# EAGLE design Stm32-mez (EAGLE 7.2.0)
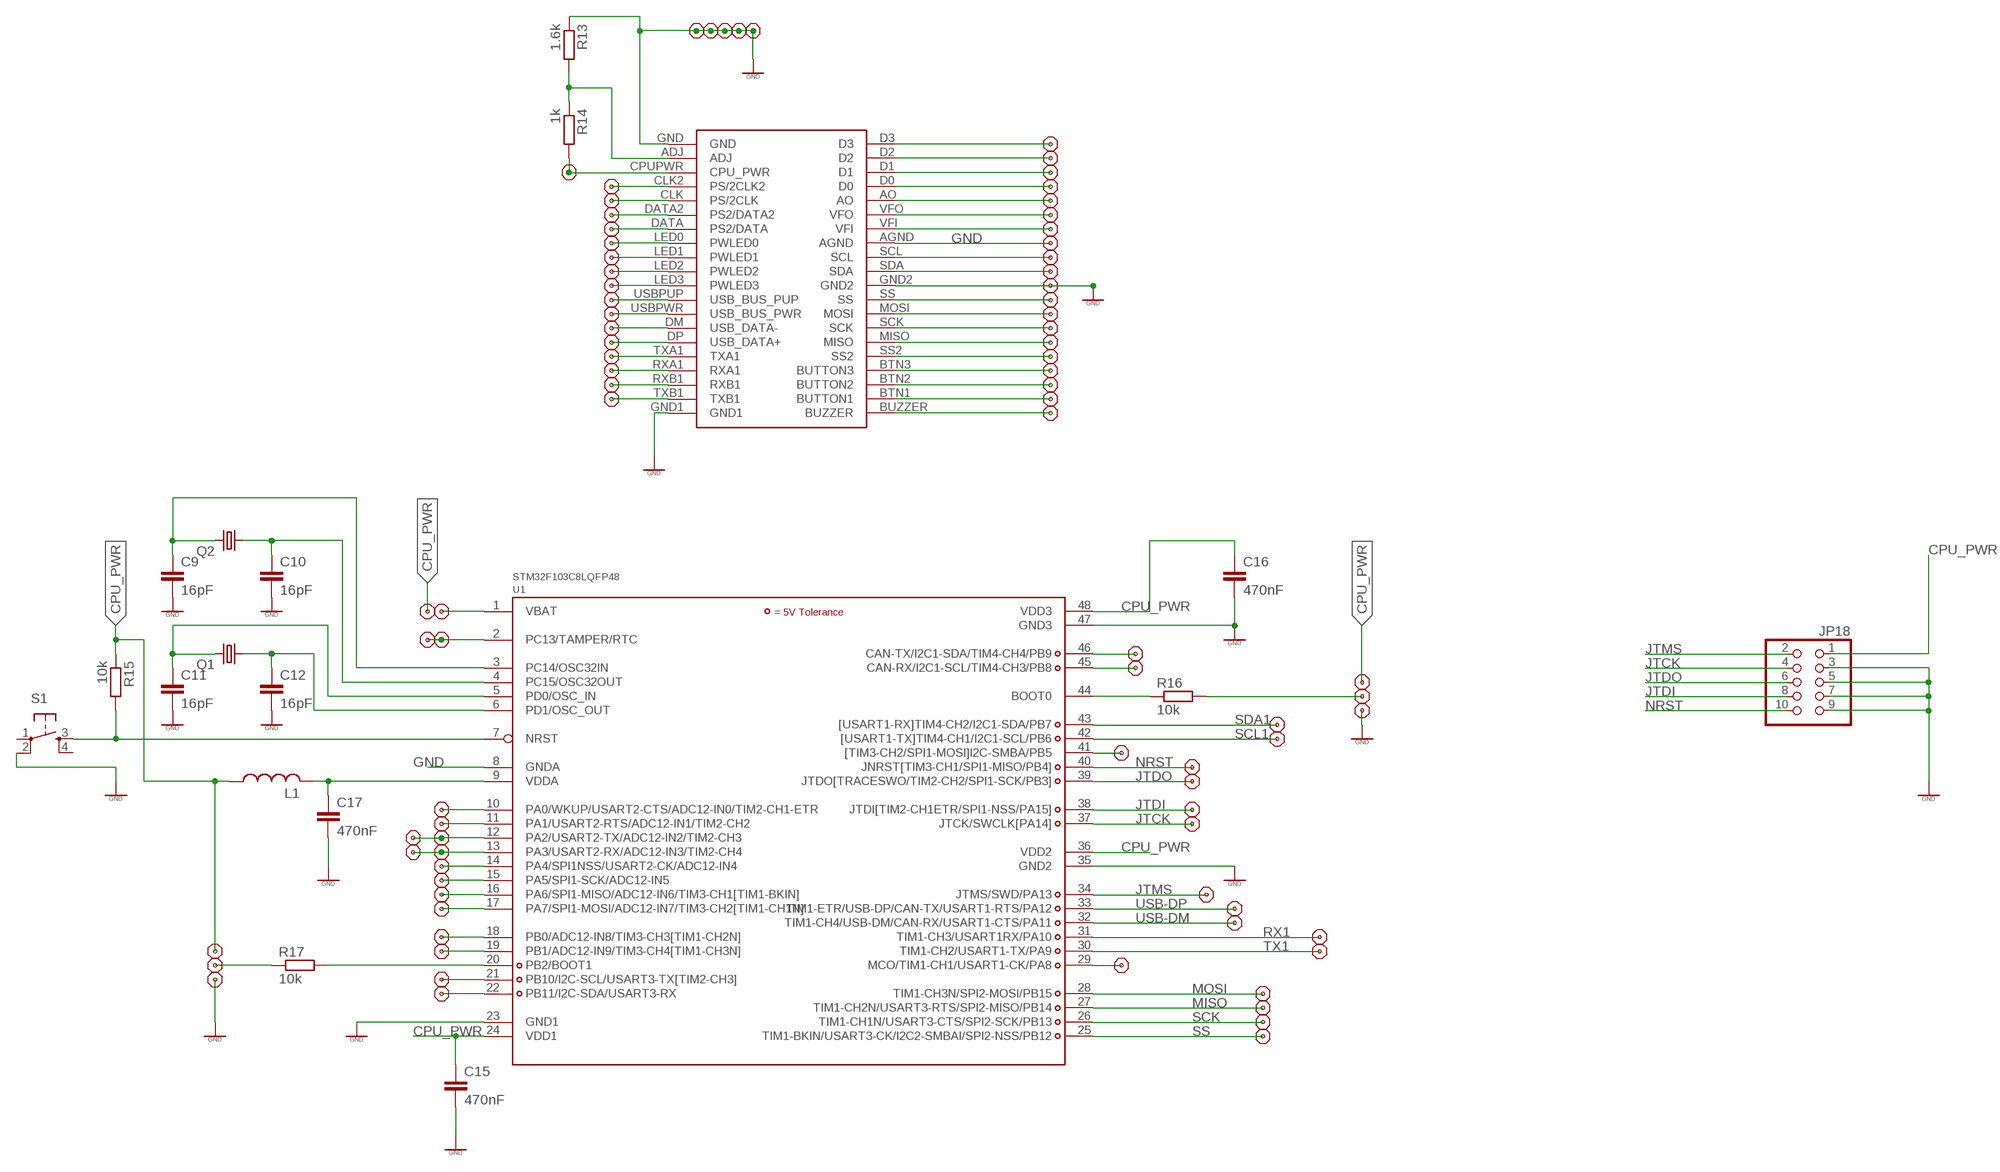
[diagram p0: schematic, sheet 1]

## Parts
C9  16pF  C-EUC1206  [C1206]
C10  16pF  C-EUC1206  [C1206]
C11  16pF  C-EUC1206  [C1206]
C12  16pF  C-EUC1206  [C1206]
C15  470nF  C-EUC1206  [C1206]
C16  470nF  C-EUC1206  [C1206]
C17  470nF  C-EUC1206  [C1206]
JP5  PINHD-1X1PIN  [1X01]
JP6  PINHD-1X1PIN  [1X01]
JP7  PINHD-1X1PIN  [1X01]
JP8  PINHD-1X1PIN  [1X01]
JP10  PINHD-1X1PIN  [1X01]
JP11  PINHD-1X1PIN  [1X01]
JP12  PINHD-1X1PIN  [1X01]
JP13  PINHD-1X1PIN  [1X01]
JP14  PINHD-1X1PIN  [1X01]
JP15  PINHD-1X1PIN  [1X01]
JP16  PINHD-1X1PIN  [1X01]
JP17  PINHD-1X1PIN  [1X01]
JP18  PINHD-2X5  [2X05]
JP19  PINHD-1X1PIN  [1X01]
JP20  PINHD-1X1PIN  [1X01]
JP21  PINHD-1X1PIN  [1X01]
JP22  PINHD-1X1PIN  [1X01]
JP23  PINHD-1X1PIN  [1X01]
JP24  PINHD-1X1PIN  [1X01]
JP25  PINHD-1X1PIN  [1X01]
JP26  PINHD-1X1PIN  [1X01]
JP27  PINHD-1X1PIN  [1X01]
JP28  PINHD-1X1PIN  [1X01]
JP29  PINHD-1X1PIN  [1X01]
JP30  PINHD-1X1PIN  [1X01]
JP31  PINHD-1X1PIN  [1X01]
JP32  PINHD-1X1PIN  [1X01]
JP33  PINHD-1X1PIN  [1X01]
JP34  PINHD-1X1PIN  [1X01]
JP35  PINHD-1X1PIN  [1X01]
JP36  PINHD-1X1PIN  [1X01]
JP37  PINHD-1X1PIN  [1X01]
JP38  PINHD-1X1PIN  [1X01]
JP39  PINHD-1X1PIN  [1X01]
JP40  PINHD-1X1PIN  [1X01]
JP41  PINHD-1X1PIN  [1X01]
JP42  PINHD-1X1PIN  [1X01]
JP43  PINHD-1X1PIN  [1X01]
JP44  PINHD-1X1PIN  [1X01]
JP45  PINHD-1X1PIN  [1X01]
JP46  PINHD-1X1PIN  [1X01]
JP47  PINHD-1X1PIN  [1X01]
JP48  PINHD-1X1PIN  [1X01]
JP49  PINHD-1X1PIN  [1X01]
JP50  PINHD-1X1PIN  [1X01]
JP51  PINHD-1X1PIN  [1X01]
JP52  PINHD-1X1PIN  [1X01]
JP53  PINHD-1X1PIN  [1X01]
JP54  PINHD-1X1PIN  [1X01]
JP55  PINHD-1X1PIN  [1X01]
JP56  PINHD-1X1PIN  [1X01]
JP57  PINHD-1X1PIN  [1X01]
JP58  PINHD-1X1PIN  [1X01]
JP59  PINHD-1X1PIN  [1X01]
JP60  PINHD-1X1PIN  [1X01]
JP61  PINHD-1X1PIN  [1X01]
JP62  PINHD-1X1PIN  [1X01]
JP63  PINHD-1X1PIN  [1X01]
JP64  PINHD-1X1PIN  [1X01]
JP65  PINHD-1X1PIN  [1X01]
JP66  PINHD-1X1PIN  [1X01]
JP67  PINHD-1X1PIN  [1X01]
JP68  PINHD-1X1PIN  [1X01]
JP69  PINHD-1X1PIN  [1X01]
JP70  PINHD-1X1PIN  [1X01]
JP71  PINHD-1X1PIN  [1X01]
JP72  PINHD-1X1PIN  [1X01]
JP73  PINHD-1X1PIN  [1X01]
JP74  PINHD-1X1PIN  [1X01]
JP75  PINHD-1X1PIN  [1X01]
JP76  PINHD-1X1PIN  [1X01]
JP77  PINHD-1X1PIN  [1X01]
JP78  PINHD-1X1PIN  [1X01]
JP79  PINHD-1X1PIN  [1X01]
JP80  PINHD-1X1PIN  [1X01]
JP81  PINHD-1X1PIN  [1X01]
JP82  PINHD-1X1PIN  [1X01]
JP83  PINHD-1X1PIN  [1X01]
JP84  PINHD-1X1PIN  [1X01]
JP85  PINHD-1X1PIN  [1X01]
JP86  PINHD-1X1PIN  [1X01]
JP87  PINHD-1X1PIN  [1X01]
JP88  PINHD-1X1PIN  [1X01]
JP89  PINHD-1X1PIN  [1X01]
JP90  PINHD-1X1PIN  [1X01]
JP91  PINHD-1X1PIN  [1X01]
L1  L-US0207/15  [0207/15]
Q1  CRYSTALHC49U-V  [HC49U-V]
Q2  CRYSTALTC26H  [TC26H]
R13  1.6k  R-EU_R1206  [R1206]
R14  1k  R-EU_R1206  [R1206]
R15  10k  R-EU_R1206  [R1206]
R16  10k  R-EU_R1206  [R1206]
R17  10k  R-EU_R1206  [R1206]
S1  TAC_SWITCHPTH  [TACTILE-PTH]
U1  STM32F103C8LQFP48  [LQFP48]
U$2  CPU_CON  [CPU_SHIELD]

## Nets
CPU_PWR: C15.1 C16.1 JP5.1 JP16.1 JP18.1 JP24.1 JP54.1 L1.1 R14.2 R15.1 U1.24(VDD1) U1.36(VDD2) U1.48(VDD3) U$2.CPUPWR(CPU_PWR)
GND: C9.2 C10.2 C11.2 C12.2 C15.2 C16.2 C17.2 JP10.1 JP11.1 JP12.1 JP13.1 JP14.1 JP18.3 JP18.5 JP18.7 JP18.9 JP25.1 JP55.1 JP90.1 JP91.1 R13.1 S1.2 U1.8(GNDA) U1.23(GND1) U1.35(GND2) U1.47(GND3) U$2.AGND U$2.GND U$2.GND1 U$2.GND2
JTCK: JP18.4 JP22.1 U1.37(JTCK/SWCLK[PA14])
JTDI: JP18.8 JP21.1 U1.38(JTDI[TIM2-CH1ETR/SPI1-NSS/PA15])
JTDO: JP18.6 JP20.1 U1.39(JTDO[TRACESWO/TIM2-CH2/SPI1-SCK/PB3])
JTMS: JP18.2 JP26.1 U1.34(JTMS/SWD/PA13)
MISO: JP32.1 U1.27(TIM1-CH2N/USART3-RTS/SPI2-MISO/PB14)
MOSI: JP31.1 U1.28(TIM1-CH3N/SPI2-MOSI/PB15)
N$1: R15.2 S1.3 U1.7(NRST)
N$3: R13.2 R14.1 U$2.ADJ
N$4: C12.1 Q1.1 U1.6(PD1/OSC_OUT)
N$5: C11.1 Q1.2 U1.5(PD0/OSC_IN)
N$14: C10.1 Q2.1 U1.4(PC15/OSC32OUT)
N$15: C9.1 Q2.2 U1.3(PC14/OSC32IN)
N$17: JP8.1 JP17.1 U1.2(PC13/TAMPER/RTC)
N$19: R16.1 U1.44(BOOT0)
N$20: JP23.1 R16.2
N$21: JP38.1 U1.46(CAN-TX/I2C1-SDA/TIM4-CH4/PB9)
N$22: JP37.1 U1.45(CAN-RX/I2C1-SCL/TIM4-CH3/PB8)
N$23: JP39.1 U1.41([TIM3-CH2/SPI1-MOSI]I2C-SMBA/PB5)
N$24: JP40.1 U1.29(MCO/TIM1-CH1/USART1-CK/PA8)
N$25: JP41.1 U1.10(PA0/WKUP/USART2-CTS/ADC12-IN0/TIM2-CH1-ETR)
N$26: JP43.1 U1.11(PA1/USART2-RTS/ADC12-IN1/TIM2-CH2)
N$27: JP6.1 JP42.1 U1.12(PA2/USART2-TX/ADC12-IN2/TIM2-CH3)
N$28: JP7.1 JP44.1 U1.13(PA3/USART2-RX/ADC12-IN3/TIM2-CH4)
N$29: JP45.1 U1.14(PA4/SPI1NSS/USART2-CK/ADC12-IN4)
N$30: JP46.1 U1.15(PA5/SPI1-SCK/ADC12-IN5)
N$31: JP47.1 U1.16(PA6/SPI1-MISO/ADC12-IN6/TIM3-CH1[TIM1-BKIN])
N$32: JP48.1 U1.17(PA7/SPI1-MOSI/ADC12-IN7/TIM3-CH2[TIM1-CH1N])
N$33: JP49.1 U1.18(PB0/ADC12-IN8/TIM3-CH3[TIM1-CH2N])
N$34: JP50.1 U1.19(PB1/ADC12-IN9/TIM3-CH4[TIM1-CH3N])
N$35: R17.2 U1.20(PB2/BOOT1)
N$36: JP52.1 U1.21(PB10/I2C-SCL/USART3-TX[TIM2-CH3])
N$37: JP53.1 U1.22(PB11/I2C-SDA/USART3-RX)
N$38: JP51.1 R17.1
N$39: JP73.1 U$2.D3
N$40: JP72.1 U$2.D2
N$41: JP71.1 U$2.D1
N$42: JP70.1 U$2.D0
N$43: JP69.1 U$2.AO
N$44: JP68.1 U$2.VFO
N$45: JP67.1 U$2.VFI
N$46: JP66.1 U$2.SCL
N$47: JP65.1 U$2.SDA
N$48: JP64.1 U$2.SS
N$49: JP63.1 U$2.MOSI
N$50: JP62.1 U$2.SCK
N$51: JP61.1 U$2.MISO
N$52: JP60.1 U$2.SS2
N$53: JP59.1 U$2.BTN3(BUTTON3)
N$54: JP58.1 U$2.BTN2(BUTTON2)
N$55: JP57.1 U$2.BTN1(BUTTON1)
N$56: JP56.1 U$2.BUZZER
N$57: JP74.1 U$2.TXB1
N$58: JP75.1 U$2.RXB1
N$59: JP76.1 U$2.RXA1
N$60: JP77.1 U$2.TXA1
N$61: JP78.1 U$2.DP(USB_DATA+)
N$62: JP79.1 U$2.DM(USB_DATA-)
N$63: JP80.1 U$2.USBPWR(USB_BUS_PWR)
N$64: JP81.1 U$2.USBPUP(USB_BUS_PUP)
N$65: JP82.1 U$2.LED3(PWLED3)
N$66: JP83.1 U$2.LED2(PWLED2)
N$67: JP84.1 U$2.LED1(PWLED1)
N$68: JP85.1 U$2.LED0(PWLED0)
N$69: JP86.1 U$2.DATA(PS2/DATA)
N$70: JP87.1 U$2.DATA2(PS2/DATA2)
N$71: JP88.1 U$2.CLK(PS/2CLK)
N$72: JP89.1 U$2.CLK2(PS/2CLK2)
NRST: JP18.10 JP19.1 U1.40(JNRST[TIM3-CH1/SPI1-MISO/PB4])
RX1: JP27.1 U1.31(TIM1-CH3/USART1RX/PA10)
SCK: JP33.1 U1.26(TIM1-CH1N/USART3-CTS/SPI2-SCK/PB13)
SCL1: JP36.1 U1.42([USART1-TX]TIM4-CH1/I2C1-SCL/PB6)
SDA1: JP35.1 U1.43([USART1-RX]TIM4-CH2/I2C1-SDA/PB7)
SS: JP34.1 U1.25(TIM1-BKIN/USART3-CK/I2C2-SMBAI/SPI2-NSS/PB12)
TX1: JP28.1 U1.30(TIM1-CH2/USART1-TX/PA9)
USB-DM: JP29.1 U1.32(TIM1-CH4/USB-DM/CAN-RX/USART1-CTS/PA11)
USB-DP: JP30.1 U1.33(TIM1-ETR/USB-DP/CAN-TX/USART1-RTS/PA12)
VBAT: JP15.1 U1.1(VBAT)
VDDA: C17.1 L1.2 U1.9(VDDA)
Unconnected: S1.1 S1.4

## Library data of the parts
C9-C12 C15-C17 = rcl:C-EU: CAPACITOR, European symbol
JP5-JP8 JP10-JP17 JP19-JP91 = _pinhead:PINHD-1X1: PIN HEADER
JP18 = _pinhead:PINHD-2X5: PIN HEADER
L1 = rcl:L-US: INDUCTOR, American symbol
Q1 Q2 = crystal:CRYSTAL: CRYSTAL
R13-R17 = rcl:R-EU_: RESISTOR, European symbol
S1 = SparkFun:TAC_SWITCH: Momentary Switch Button commonly used for reset or general input. Spark Fun Electronics SKU : COM-00097
U1 = STM32:STM32F103C8
U$2 = _block:CPU_CON

## Board
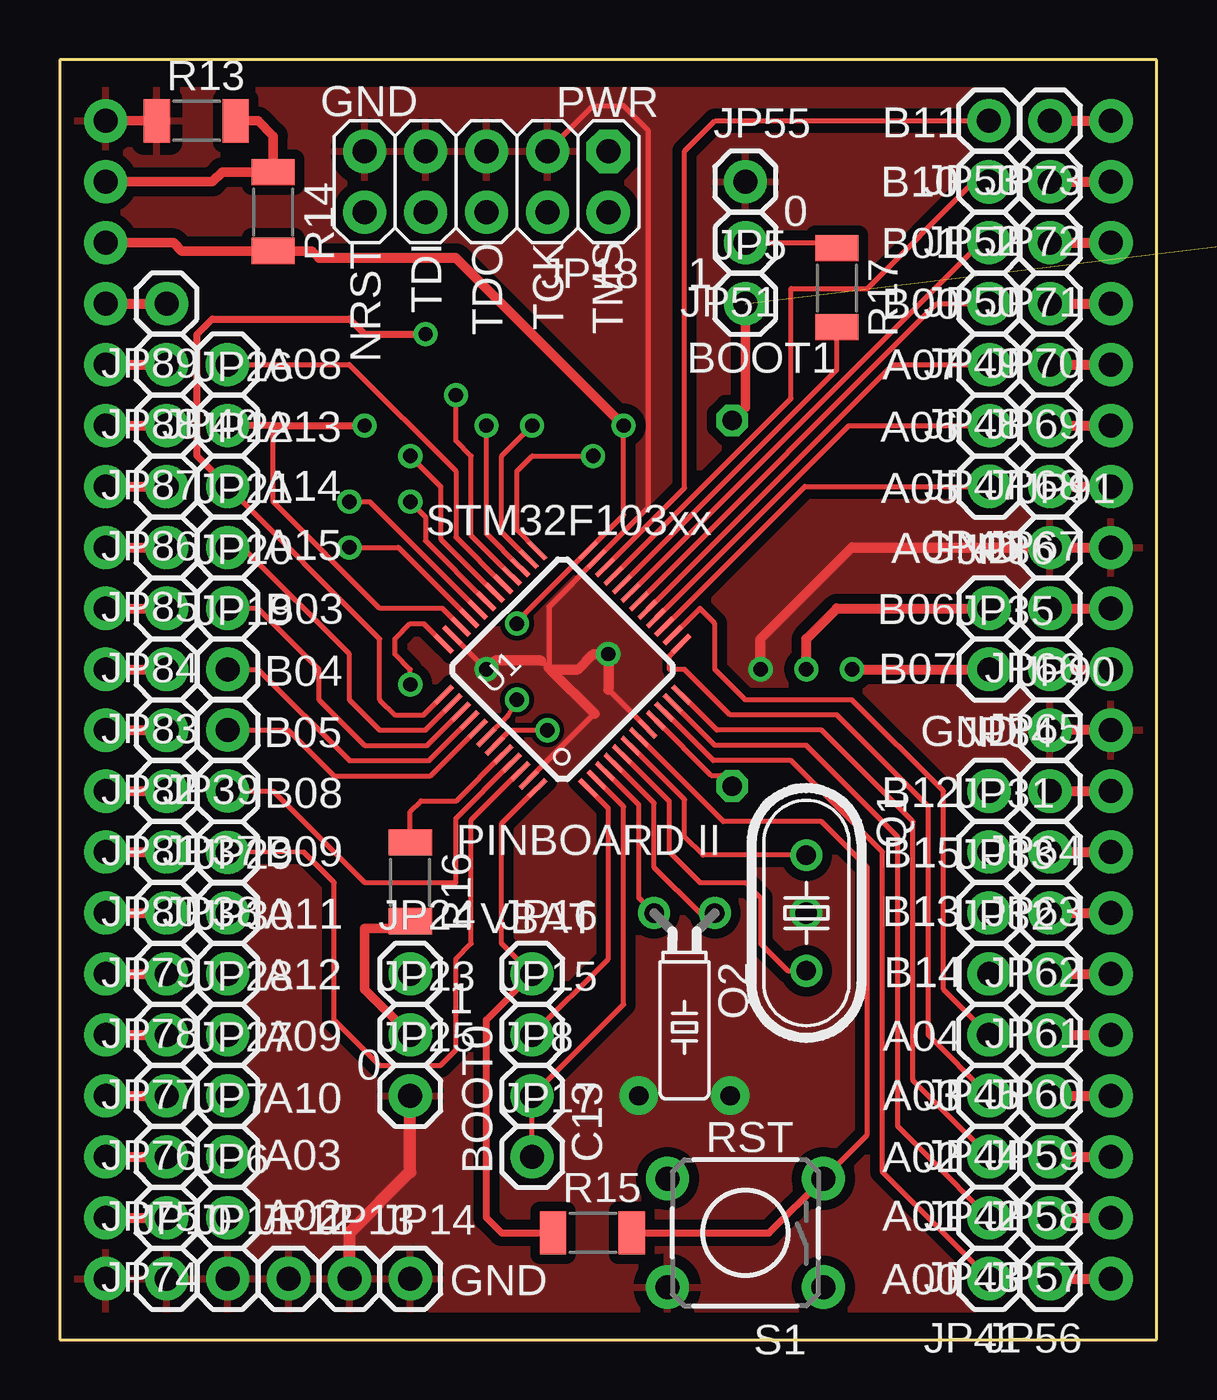
[diagram p1: board, top side]
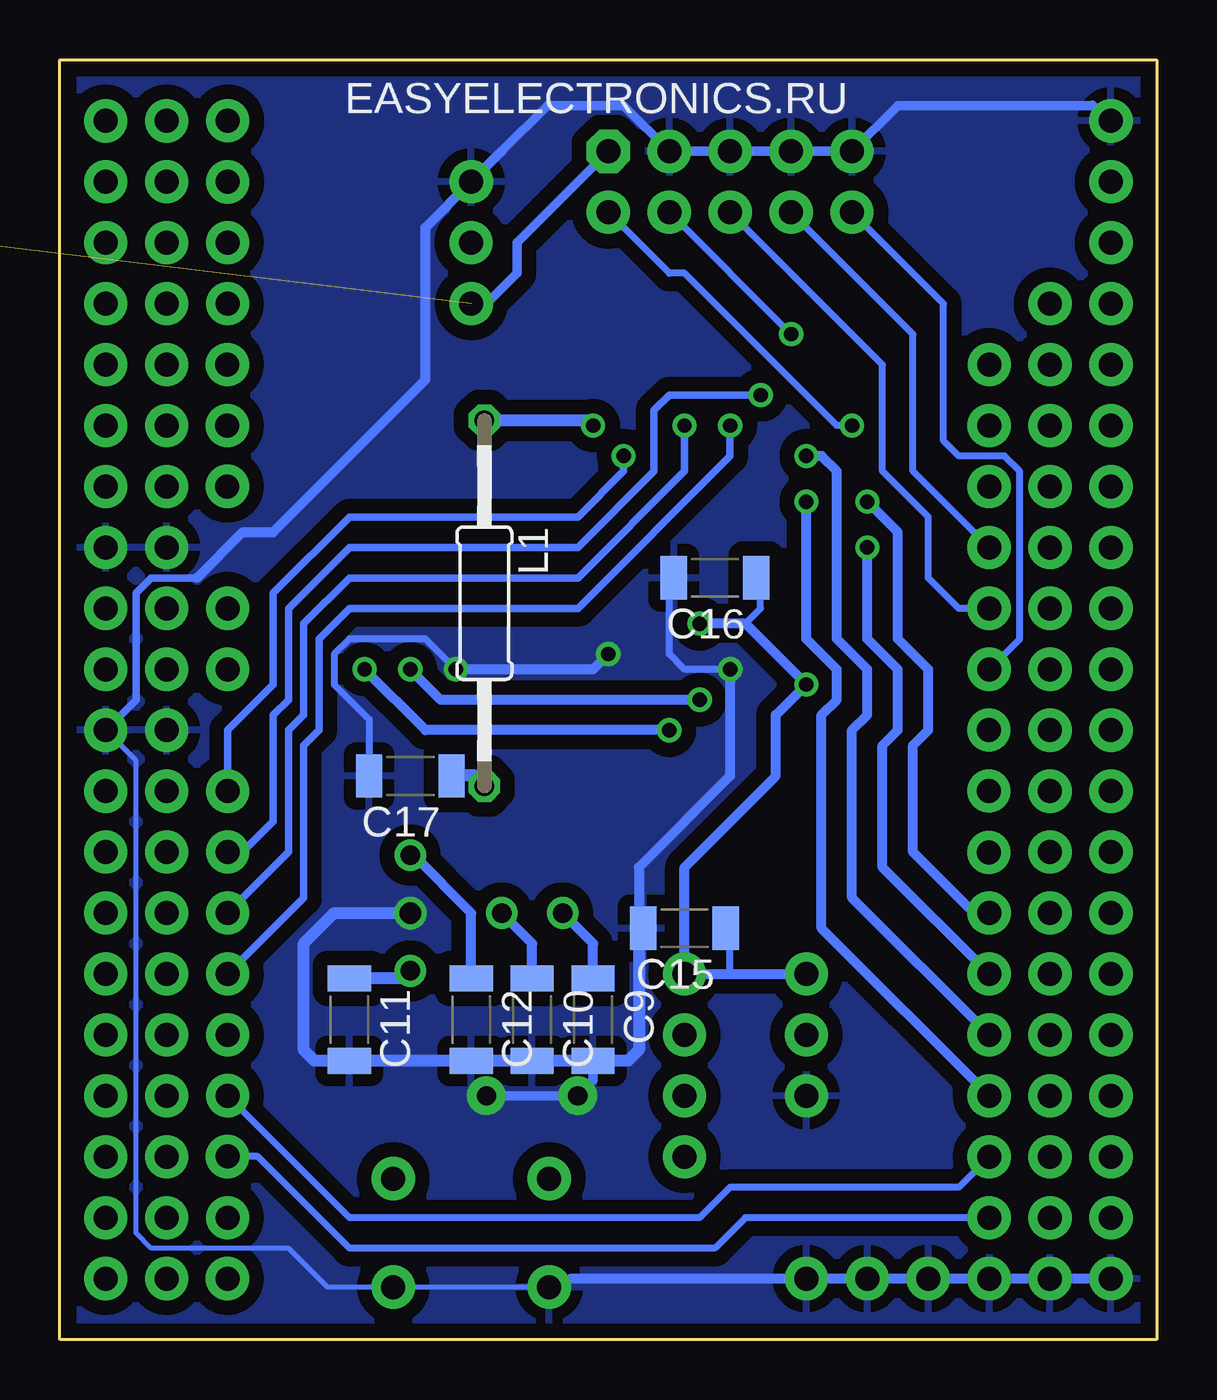
[diagram p2: board, bottom side, seen from below]

Size 45.72 x 53.34 mm. Coordinates in mm from the lower left corner, seen from the top.
Copper layers (1*16): Top 0.035mm / dielectric 1.5mm / Bottom 0.035mm
Design rules "default *": minimum track width 0.15mm, minimum drill 0.6mm, track to track 0.2mm, track to pad 0.2mm, pad to pad 0.2mm, via to via 0.2mm, smd to smd 8mil, copper to edge 0.5mm, drill to drill 8mil, minimum pad ring 10mil, minimum via ring 8mil, stop-mask expansion 4mil, vias tented up to drill 0mil, thermal gap 20mil

### Footprints (pad centres in the part's own frame; a part is rotated, then mirrored left to right if it is on the bottom)
C1206 = smd 1.092 x 1.8: 1 -1.718,0; 2 1.718,0
1X01 = drill 1 pad 1.8: 1 0,0
2X05 = drill 1 pad 1.8 octagon: 1 -5.08,-1.27 | drill 1 pad 1.8: 2 -5.08,1.27; 3 -2.54,-1.27; 4 -2.54,1.27; 5 0,-1.27; 6 0,1.27; 7 2.54,-1.27; 8 2.54,1.27; 9 5.08,-1.27; 10 5.08,1.27
0207/15 = drill 0.813 octagon: 1 -7.62,0; 2 7.62,0
HC49U-V = drill 0.813: 1 -2.413,0; 2 2.413,0
TC26H = drill 0.813: 1 -1.27,0; 2 1.27,0
R1206 = smd 1.092 x 1.803: 1 -1.676,0; 2 1.613,0
TACTILE-PTH = drill 1 pad 1.8: 1 -3.251,2.261; 2 3.251,2.261; 3 -3.251,-2.261; 4 3.251,-2.261
LQFP48 = smd 0.2 x 1: 1 -2.75,-4.25; 2 -2.25,-4.25; 3 -1.75,-4.25; 4 -1.25,-4.25; 5 -0.75,-4.25; 6 -0.25,-4.25; 7 0.25,-4.25; 8 0.75,-4.25; 9 1.25,-4.25; 10 1.75,-4.25; 11 2.25,-4.25; 12 2.75,-4.25; 25 2.75,4.25; 26 2.25,4.25; 27 1.75,4.25; 28 1.25,4.25; 29 0.75,4.25; 30 0.25,4.25; 31 -0.25,4.25; 32 -0.75,4.25; 33 -1.25,4.25; 34 -1.75,4.25; 35 -2.25,4.25; 36 -2.75,4.25 | smd 1 x 0.2: 13 4.25,-2.75; 14 4.25,-2.25; 15 4.25,-1.75; 16 4.25,-1.25; 17 4.25,-0.75; 18 4.25,-0.25; 19 4.25,0.25; 20 4.25,0.75; 21 4.25,1.25; 22 4.25,1.75; 23 4.25,2.25; 24 4.25,2.75; 37 -4.25,2.75; 38 -4.25,2.25; 39 -4.25,1.75; 40 -4.25,1.25; 41 -4.25,0.75; 42 -4.25,0.25; 43 -4.25,-0.25; 44 -4.25,-0.75; 45 -4.25,-1.25; 46 -4.25,-1.75; 47 -4.25,-2.25; 48 -4.25,-2.75
CPU_SHIELD = drill 1 pad 1.8: ADJ 0,-2.54; AGND 41.91,-17.78; AO 41.91,-10.16; BTN1 41.91,-45.72; BTN2 41.91,-43.18; BTN3 41.91,-40.64; BUZZER 41.91,-48.26; CLK 0,-10.16; CLK2 0,-7.62; CPUPWR 0,-5.08; D0 41.91,-7.62; D1 41.91,-5.08; D2 41.91,-2.54; D3 41.91,0; DATA 0,-15.24; DATA2 0,-12.7; DM 0,-33.02; DP 0,-35.56; GND 0,0; GND1 0,-48.26; GND2 41.91,-25.4; LED0 0,-17.78; LED1 0,-20.32; LED2 0,-22.86; LED3 0,-25.4; MISO 41.91,-35.56; MOSI 41.91,-30.48; RXA1 0,-40.64; RXB1 0,-43.18; SCK 41.91,-33.02; SCL 41.91,-20.32; SDA 41.91,-22.86; SS 41.91,-27.94; SS2 41.91,-38.1; TXA1 0,-38.1; TXB1 0,-45.72; USBPUP 0,-27.94; USBPWR 0,-30.48; VFI 41.91,-15.24; VFO 41.91,-12.7

### Placement (x,y rotation side)
C9  23.5,13.33 270 bottom
C10  26.03,13.33 270 bottom
C11  33.66,13.33 270 bottom
C12  28.58,13.33 270 bottom
C15  19.69,17.14 180 bottom
C16  18.41,31.75 180 bottom
C17  31.12,23.49 180 bottom
JP5  28.58,43.18 0 top
JP6  6.98,5.08 0 top
JP7  6.98,7.62 0 top
JP8  19.69,10.16 0 top
JP10  4.45,2.54 0 top
JP11  6.98,2.54 0 top
JP12  9.53,2.54 0 top
JP13  12.07,2.54 0 top
JP14  14.61,2.54 0 top
JP15  19.69,12.7 0 top
JP16  19.69,15.24 0 top
JP17  19.69,7.62 0 top
JP18  17.78,48.26 180 top
JP19  6.98,27.94 0 top
JP20  6.98,30.48 0 top
JP21  6.98,33.02 0 top
JP22  6.98,35.56 0 top
JP23  14.61,12.7 0 top
JP24  14.61,15.24 0 top
JP25  14.61,10.16 0 top
JP26  6.98,38.1 0 top
JP27  6.98,10.16 0 top
JP28  6.98,12.7 0 top
JP29  6.98,17.78 0 top
JP30  6.98,15.24 0 top
JP31  38.73,20.32 0 top
JP32  38.73,15.24 0 top
JP33  38.73,17.78 0 top
JP34  38.73,22.86 0 top
JP35  38.73,27.94 0 top
JP36  38.73,30.48 0 top
JP37  6.99,22.86 180 top
JP38  6.99,20.31 180 top
JP39  6.99,25.41 180 top
JP40  6.98,40.65 180 top
JP41  38.74,2.54 180 top
JP42  38.74,7.63 180 top
JP43  38.73,5.08 180 top
JP44  38.73,10.17 180 top
JP45  38.73,12.7 180 top
JP46  38.74,35.57 180 top
JP47  38.74,38.1 180 top
JP48  38.74,40.64 180 top
JP49  38.73,43.18 180 top
JP50  38.73,45.72 180 top
JP51  28.58,45.73 180 top
JP52  38.73,48.26 180 top
JP53  38.73,50.81 180 top
JP54  68.58,38.73 0 top  (outside the outline)
JP55  28.58,48.26 0 top
JP56  41.28,2.54 180 top
JP57  41.28,5.08 180 top
JP58  41.28,7.62 180 top
JP59  41.28,10.16 180 top
JP60  41.28,12.7 180 top
JP61  41.28,15.24 180 top
JP62  41.28,17.78 180 top
JP63  41.28,20.32 180 top
JP64  41.28,22.86 180 top
JP65  41.28,27.94 180 top
JP66  41.28,30.48 180 top
JP67  41.28,35.56 180 top
JP68  41.28,38.1 180 top
JP69  41.28,40.64 180 top
JP70  41.28,43.18 180 top
JP71  41.28,45.72 180 top
JP72  41.28,48.26 180 top
JP73  41.28,50.8 180 top
JP74  4.45,5.08 180 top
JP75  4.45,7.62 180 top
JP76  4.45,10.16 180 top
JP77  4.45,12.7 180 top
JP78  4.45,15.24 180 top
JP79  4.45,17.78 180 top
JP80  4.45,20.32 180 top
JP81  4.45,22.86 180 top
JP82  4.45,25.4 180 top
JP83  4.45,27.94 180 top
JP84  4.45,30.48 180 top
JP85  4.45,33.02 180 top
JP86  4.45,35.56 180 top
JP87  4.45,38.1 180 top
JP88  4.45,40.64 180 top
JP89  4.45,43.18 180 top
JP90  41.28,25.4 0 top
JP91  41.28,33.02 0 top
L1  28.03,30.7 270 bottom
Q1  31.12,17.78 270 top
Q2  26.03,17.78 180 top
R13  5.72,50.8 0 top
R14  8.89,46.99 270 top
R15  22.23,4.44 0 top
R16  14.61,19.05 270 top
R17  32.39,43.81 270 top
S1  28.58,4.44 180 top
U1  20.95,27.94 45 top
U$2  1.91,50.8 0 top

### Tracks (layer width: path | path; a pad name or v marks a point on that pad's centre or on a via)
CPU_PWR  (via drill 0.6)  (11 unrouted)
  Top 0.2: U1.48 18.41,21.51 18.41,16.51 JP16.1 | U1.36 15.16,29.84 14.61,29.84 13.97,29.21 13.97,28.57 14.61,27.94 v14.61,27.3 | v19.05,29.84 19.05,29.92 U1.24 23.5,34.37 v23.5,38.1
  Top 0.3: JP16.1 17.78,13.33 17.78,5.08 18.41,4.44 R15.1
  Top 0.4: JP5.1 28.58,38.85 28.56,38.85 L1.1 | U$2.CPUPWR 4.74,45.72 5.08,45.38 R14.2 10.5,45.38 10.8,45.08
  Top 0.406: v23.5,38.1 16.51,45.08 10.8,45.08
  Bottom 0.3: C15.1 17.78,16.32 17.78,15.24 | C16.1 16.51,32.2 16.51,30.48 17.15,29.84
  Bottom 0.4: JP18.1 26.67,45.72 26.67,44.45 27.94,43.18 JP5.1
  Bottom 0.406: JP24.1 17.78,15.24 JP16.1 19.69,19.68 15.88,23.49 15.88,26.03 v14.61,27.3 17.15,29.84 v19.05,29.84
  Bottom 0.5: L1.1 23.71,38.31 v23.5,38.1
GND  (via drill 0.6, 0.8 pad 1.6, 0.9)
  Top 0.2: 22.29,26.09 U1.47 | 16.37,29.35 U1.35 v17.77,27.94 v17.78,27.94 | 20.08,28.3 20.38,28 20.38,30.54 U1.23 24.51,34.68 24.51,50.42 23.5,51.43 22.23,51.43 JP18.3 | 22.86,27.1 U1.8
  Top 0.4: U$2.GND R13.1
  Top 0.406: 20.44,27.94 22.29,26.09 | 20.08,28.3 18.14,28.3 v17.78,27.94 | v29.21,27.94 29.21,29.21 33.02,33.02 JP91.1 U$2.AGND | 22.86,27.1 v22.86,28.57 22.23,28.57 21.59,27.94 20.44,27.94 | 20.38,28 20.44,27.94 | U$2.GND2 JP90.1
  Top 0.5: JP25.1 14.61,6.98 12.07,4.44 JP13.1
  Bottom 0.2: 1.97,50.74 U$2.GND | C9.2 23.31,11.43 | U$2.GND2 42.55,24.13 42.55,4.44 41.91,3.81 36.2,3.81 34.57,2.18 S1.2
  Bottom 0.3: 21.59,17.14 C15.2 | C16.2 20.32,32.2 20.32,28.57 19.69,27.94 v17.78,27.94 | C17.2 32.83,25.85 34.29,27.3 34.29,28.57 33.66,29.21 30.48,29.21 v29.21,27.94
  Bottom 0.305: U$2.GND2 42.55,26.67 42.55,31.11 41.91,31.75 40,31.75
  Bottom 0.4: C12.2 28.76,11.43 | 23.5,11.43 C9.2 23.5,10.79 v24.13,10.16 v27.94,10.16 | 27.31,49.53 25.4,51.43 22.23,51.43 JP18.3 JP18.5 JP18.7 JP18.9 10.8,51.43 2.66,51.43
  Bottom 0.406: 2.66,51.43 1.97,50.74 | 27.31,49.53 JP55.1 30.48,46.35 30.48,40 36.83,33.65 38.1,33.65 40,31.75 | 21.59,17.14 21.59,19.68 17.78,23.49 v17.78,27.94 | v29.21,27.94 23.5,27.94 v22.86,28.57 | U$2.GND1 JP10.1 JP11.1 JP12.1 JP13.1 JP14.1 24.41,2.54 S1.2
  Bottom 0.5: C9.2 22.04,11.62 21.59,12.06 21.59,17.14 | 23.5,11.43 23.68,11.62 C10.2 C12.2 C11.2 35.11,11.62 35.56,12.06 35.56,16.51 34.29,17.78 v31.12,17.78
  pour Top: 16.51,27.94 20.95,32.38 25.4,27.94 20.95,23.49
  pour Top (isolate 0.406): 45.09,1.27 0.64,1.27 0.64,52.07 45.09,52.07
  pour Bottom (isolate 0.61): 0.64,0.63 0.64,52.7 45.09,52.7 45.09,0.63
JTCK  (via drill 0.6)
  Top 0.2: U1.37 15.16,26.03 13.97,26.03 13.34,26.67 13.34,29.21 JP22.1
  Top 0.3: JP22.1 5.72,36.83 5.72,41.91 6.35,42.54 12.07,42.54 12.7,41.91 v15.24,41.91
  Bottom 0.3: v15.24,41.91 JP18.4
JTDI
  Top 0.2: U1.38 15.23,25.4 13.34,25.4 12.07,26.67 12.07,28.57 7.62,33.02 JP21.1
  Bottom 0.3: JP18.8 10.16,41.91 10.16,36.19 JP21.1
JTDO
  Top 0.2: U1.39 15.3,24.76 12.7,24.76 10.8,26.67 10.8,27.94 8.26,30.48 JP20.1
  Bottom 0.3: JP18.6 11.43,40.64 11.43,36.19 9.53,34.29 9.53,31.75 8.26,30.48 JP20.1
JTMS  (via drill 0.6)
  Top 0.2: U1.34 15.94,30.48 13.34,30.48 8.89,34.92 8.89,38.1
  Top 0.3: JP26.1 8.89,38.1 v12.7,38.1
  Bottom 0.3: JP18.2 20.32,44.45 19.69,44.45 13.34,38.1 v12.7,38.1
MISO  (via drill 0.6)
  Top 0.2: U1.27 17.78,33.59 v17.78,38.1
  Bottom 0.305: JP32.1 35.56,18.41 35.56,24.76 34.92,25.4 34.92,29.21 33.66,30.48 24.13,30.48 17.78,36.83 v17.78,38.1
MOSI  (via drill 0.6)
  Top 0.2: U1.28 17.15,33.52 17.15,36.83 16.51,37.46 v16.51,39.37
  Bottom 0.305: JP31.1 38.1,20.32 36.83,21.59 36.83,26.03 36.2,26.67 36.2,30.48 33.66,33.02 24.13,33.02 20.95,36.19 20.95,38.73 20.32,39.37 v16.51,39.37
N$1
  Top 0.2: U1.7 27.66,21.59 31.75,21.59 33.66,19.68 33.66,8.53 S1.3
  Top 0.3: S1.3 29.57,4.44 R15.2
N$3
  Top 0.4: R13.2 8.26,50.8 8.89,50.16 R14.1 6.76,48.67 6.35,48.26 U$2.ADJ
N$4
  Top 0.2: U1.6 26.03,22.51 26.03,20.95 26.8,20.19 Q1.1
  Bottom 0.2: 30.99,20.19 Q1.1
  Bottom 0.406: C12.1 28.58,17.78 30.99,20.19
N$5
  Top 0.2: U1.5 25.4,22.43 25.4,20.32 26.67,19.05 28.58,19.05 29.21,18.41 29.21,16.51 30.35,15.37 Q1.2
  Bottom 0.5: C11.1 31.43,15.05 Q1.2
N$14
  Top 0.2: U1.4 24.77,22.36 24.77,19.68 26.67,17.78 Q2.1
  Bottom 0.406: C10.1 26.03,16.51 Q2.1
N$15
  Top 0.2: U1.3 24.13,22.29 24.13,18.41 Q2.2
  Bottom 0.406: C9.1 23.5,16.51 Q2.2
N$17
  Top 0.2: U1.2 23.5,22.22 23.5,13.97 JP8.1 JP17.1
N$19
  Top 0.2: U1.44 16.53,22.45 15.05,22.45 14.61,22.01 R16.1
N$20
  Top 0.2: 14.64,17.4 R16.2 13.97,17.14 | JP23.1
  Top 0.4: JP23.1 12.7,14.6 12.7,17.14 13.97,17.14
N$21
  Top 0.2: U1.46 17.15,21.65 17.15,16.51 16.51,15.87 16.51,12.06 15.88,11.43 13.34,11.43 11.43,13.33 11.43,19.05 10.16,20.32 JP38.1
N$22
  Top 0.2: U1.45 16.51,21.73 16.51,19.05 12.7,19.05 8.89,22.86 JP37.1
N$23
  Top 0.2: U1.41 15.45,23.49 11.43,23.49 9.52,25.41 JP39.1
N$24
  Top 0.2: U1.29 16.51,33.45 16.51,36.19 12.06,40.65 JP40.1
N$25
  Top 0.2: 36.83,4.44 34.29,6.98 34.29,20.32 30.48,24.13 27.24,24.13 U1.10 | 36.83,4.44 | JP41.1 36.83,4.44
N$26
  Top 0.2: U1.11 27.31,24.76 31.12,24.76 34.92,20.95 34.92,8.89 36.2,7.62 36.2,7.61 JP43.1
N$27
  Top 0.2: JP42.1 36.83,9.53 36.83,9.52 35.56,10.79 35.56,21.59 31.75,25.4 27.38,25.4 U1.12
  Bottom 0.3: JP6.1 17.15,5.08 18.41,3.81 33.66,3.81 37.47,7.63 JP42.1
N$28
  Top 0.2: JP44.1 36.2,12.7 36.2,22.22 32.39,26.03 27.94,26.03 26.03,27.94 25.4,27.94 25.4,28.5 U1.13
  Bottom 0.3: JP7.1 8.26,6.35 17.78,6.35 19.05,5.08 33.66,5.08 JP44.1
N$29
  Top 0.2: JP45.1 36.83,14.6 36.83,22.86 33.02,26.67 28.58,26.67 27.31,27.94 27.31,29.84 26.67,30.47 U1.14
N$30
  Top 0.2: U1.15 31.06,35.56 JP46.1
N$31
  Top 0.2: U1.16 32.88,38.1 JP47.1
N$32
  Top 0.2: U1.17 34.72,40.64 JP48.1
N$33
  Top 0.2: U1.18 36.55,43.18 JP49.1
N$34
  Top 0.2: U1.19 38.39,45.72 JP50.1
N$35
  Top 0.2: U1.20 32.39,40.43 R17.2
N$36
  Top 0.2: U1.21 30.48,39.23 30.48,43.81 33.66,43.81 38.1,48.26 JP52.1
N$37
  Top 0.2: U1.22 26.03,35.49 26.03,49.53 27.31,50.8 JP53.1
N$38
  Top 0.2: R17.1 31.52,45.73 JP51.1
N$39
  Top 0.406: JP73.1 U$2.D3
N$40
  Top 0.406: JP72.1 U$2.D2
N$41
  Top 0.406: JP71.1 U$2.D1
N$42
  Top 0.406: JP70.1 U$2.D0
N$43
  Top 0.406: JP69.1 U$2.AO
N$44
  Top 0.406: JP68.1 U$2.VFO
N$45
  Top 0.406: JP67.1 U$2.VFI
N$46
  Top 0.406: JP66.1 U$2.SCL
N$47
  Top 0.406: JP65.1 U$2.SDA
N$48
  Top 0.406: JP64.1 U$2.SS
N$49
  Top 0.406: JP63.1 U$2.MOSI
N$50
  Top 0.406: JP62.1 U$2.SCK
N$51
  Top 0.406: JP61.1 U$2.MISO
N$52
  Top 0.406: JP60.1 U$2.SS2
N$53
  Top 0.406: JP59.1 U$2.BTN3
N$54
  Top 0.406: JP58.1 U$2.BTN2
N$55
  Top 0.406: JP57.1 U$2.BTN1
N$56
  Top 0.406: JP56.1 U$2.BUZZER
N$57
  Top 0.406: U$2.TXB1 JP74.1
N$58
  Top 0.406: U$2.RXB1 JP75.1
N$59
  Top 0.406: U$2.RXA1 JP76.1
N$60
  Top 0.406: U$2.TXA1 JP77.1
N$61
  Top 0.406: U$2.DP JP78.1
N$62
  Top 0.406: U$2.DM JP79.1
N$63
  Top 0.406: U$2.USBPWR JP80.1
N$64
  Top 0.406: U$2.USBPUP JP81.1
N$65
  Top 0.406: U$2.LED3 JP82.1
N$66
  Top 0.406: U$2.LED2 JP83.1
N$67
  Top 0.406: U$2.LED1 JP84.1
N$68
  Top 0.406: U$2.LED0 JP85.1
N$69
  Top 0.406: U$2.DATA JP86.1
N$70
  Top 0.406: U$2.DATA2 JP87.1
N$71
  Top 0.406: U$2.CLK JP88.1
N$72
  Top 0.406: U$2.CLK2 JP89.1
NRST
  Top 0.2: U1.40 15.38,24.13 12.07,24.13 8.26,27.94 JP19.1
  Bottom 0.3: JP18.10 8.89,43.18 8.89,37.46 8.26,36.83 6.35,36.83 5.72,36.19 5.72,29.21 JP19.1
RX1  (via drill 0.6)
  Top 0.2: U1.31 15.24,33.3 15.24,34.29 v14.61,34.92
  Bottom 0.406: JP27.1 13.97,17.14 13.97,26.03 13.34,26.67 13.34,27.94 14.61,29.21 v14.61,34.92
SCK  (via drill 0.6)
  Top 0.2: U1.26 18.41,33.66 18.41,36.83 v19.69,38.1
  Bottom 0.305: JP33.1 36.2,20.32 36.2,25.4 35.56,26.03 35.56,29.84 33.66,31.75 24.13,31.75 19.69,36.19 v19.69,38.1
SCL1  (via drill 0.6)
  Top 0.2: v19.05,26.67 18.7,26.03 U1.42
  Top 0.406: JP36.1 32.39,30.48 31.12,29.21 v31.12,27.94
  Bottom 0.406: v31.12,27.94 29.84,26.67 v19.05,26.67
SDA1  (via drill 0.6)
  Top 0.2: v20.32,25.4 18.77,25.4 U1.43
  Top 0.406: v33.02,27.94 JP35.1
  Bottom 0.406: v33.02,27.94 30.48,25.4 v20.32,25.4
SS  (via drill 0.6)
  Top 0.2: U1.25 19.05,33.73 19.05,36.19 19.69,36.83 v22.23,36.83
  Bottom 0.305: JP34.1 38.73,25.4 36.83,27.3 36.83,31.11 33.66,34.29 24.13,34.29 22.23,36.19 v22.23,36.83
TX1  (via drill 0.6)
  Top 0.2: U1.30 15.88,33.37 15.88,35.56 v14.61,36.83
  Bottom 0.406: JP28.1 12.7,18.41 12.7,25.4 12.07,26.03 12.07,27.94 13.34,29.21 13.34,36.19 13.97,36.83 v14.61,36.83
USB-DM  (via drill 0.6)
  Top 0.2: U1.32 12.91,34.92 v12.07,34.92
  Bottom 0.406: JP29.1 7.62,17.78 10.16,20.32 10.16,24.76 9.53,25.4 9.53,27.94 10.8,29.21 10.8,33.65 v12.07,34.92
USB-DP  (via drill 0.6)
  Top 0.2: U1.33 14.11,33.02 v12.07,33.02
  Bottom 0.406: JP30.1 11.43,19.68 11.43,24.76 10.8,25.4 10.8,27.94 12.07,29.21 v12.07,33.02
VBAT
  Top 0.2: U1.1 22.86,22.15 22.86,15.87 JP15.1
VDDA
  Top 0.2: U1.9 27.14,23.52 27.58,23.52 L1.2
  Bottom 0.4: 29.37,23.52 C17.1
  Bottom 0.5: 29.37,23.52 28.47,23.52 L1.2

### Text on the board
tPlace: PWR | GND | B11 | B10 | 0 | B01 | NRST | TDI | TDO | TCK | TMS | 1 | B00 | A07 | A08 | BOOT1 | A06 | A13 | A05 | A14 | STM32F103xx | AGND | A15 | B06 | B03 | B07 | B04 | GND | B05 | B12 | B08 | B15 | PINBOARD II | B09 | B13 | A11 | VBAT | B14 | A12 | 1 | A04 | A09 | 0 | C13 | A03 | A10 | A02 | A03 | BOOT0 | RST | A01 | A02 | A00 | GND
bPlace: EASYELECTRONICS.RU | EASYELECTRONICS.RU | EASYELECTRONICS.RU | AVR JTAG | RST | TDO | TMS | TDI | TCK